# Altium schematic sheet usb_uart.SchDoc: Edison Breakout
size Letter; Author: Ye-Sheng Kuo; Revision: 1; SheetTotal: 9
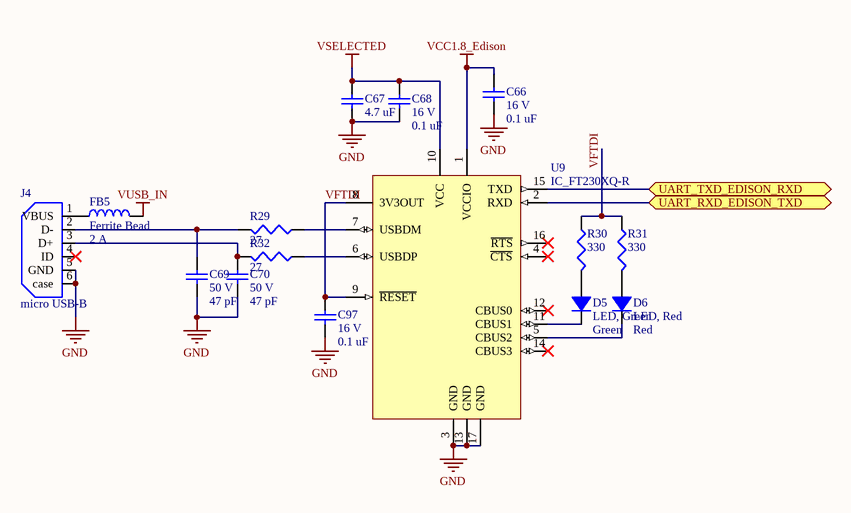
[diagram p0: usb_uart.SchDoc]

## Parts
C66  value 0.1 uF  voltage rated: 16 V  [0402]  (hidden comment: Ceramic capacitor)
C67  value 4.7 uF  [0603]  (hidden comment: Ceramic capacitor)
C68  value 0.1 uF  voltage rated: 16 V  [0402]  (hidden comment: Ceramic capacitor)
C69  value 47 pF  voltage rated: 50 V  [0402]  (hidden comment: Ceramic capacitor)
C70  value 47 pF  voltage rated: 50 V  [0402]  (hidden comment: Ceramic capacitor)
C97  value 0.1 uF  voltage rated: 16 V  [0402]  (hidden comment: Ceramic capacitor)
D5  LED, Green  Color: Green  [0402 - DIODE]
D6  LED, Red  Color: Red  [0402 - DIODE]
FB5  Ferrite Bead  current rating: 2 A  [0603]
J4  micro USB-B  [Micro USB-B]
R29  value 27  [0402]  (hidden comment: Chip resistor)
R30  value 330  [0402]  (hidden comment: Chip resistor)
R31  value 330  [0402]  (hidden comment: Chip resistor)
R32  value 27  [0402]  (hidden comment: Chip resistor)
U9  IC_FT230XQ-R  [QFN-16]

## Ports
UART_RXD_EDISON_TXD, UART_TXD_EDISON_RXD

## Nets
GND: C66.2 C67.2 C68.2 C69.2 C70.2 C97.2 J4.5(GND) J4.6(case) U9.3(GND) U9.13(GND) U9.17(GND)
VCC1.8_Edison: C66.1 U9.1(VCCIO)
VSELECTED: C67.1 C68.1 U9.10(VCC)
VUSB_IN: FB5.1
UART_RXD_EDISON_TXD: U9.2(RXD) ; port UART_RXD_EDISON_TXD
UART_TXD_EDISON_RXD: U9.15(TXD) ; port UART_TXD_EDISON_RXD
VFTDI: C97.1 R30.2 R31.2 U9.8(3V3OUT) U9.9(~{RESET})
NetC69_1: C69.1 J4.2(D-) R29.1
NetC70_1: C70.1 J4.3(D+) R32.1
NetD5_1: D5.1 R30.1
NetD5_2: D5.2 U9.11(CBUS1)
NetD6_1: D6.1 R31.1
NetD6_2: D6.2 U9.5(CBUS2)
NetFB5_2: FB5.2 J4.1(VBUS)
NetR29_2: R29.2 U9.7(USBDM)
NetR32_2: R32.2 U9.6(USBDP)

Not connected (* = marked no-connect by the designer): J4 4(ID)*; U9 4(~{CTS})* 12(CBUS0)* 14(CBUS3)* 16(~{RTS})*

## Notes on the sheet
- Title
- Date:
- Author:
- Revision:
- Sheet
- of
- University of Michigan
- File:

## Library data of the parts
C66 C68 C97 = C_0.1u_16V_0402_ceramic: Ceramic capacitor, 0.1u, 16 V, 0402 package; Manufacture: Murata; tolerance: 10%; Temperature Coef: X7R; package: 0402; Supplier 1: Digi-Key; Supplier Part Number 1: 490-3261-1-ND
C67 = C_4.7u_10V_0603_ceramic: Ceramic capacitor, 4.7u, 10V, 0603 package; Manufacture: TDK; tolerance: 20%; Temp rating: X5R; package: 0603; voltage rated: 10 V; Supplier 1: Digi-Key; Supplier Part Number 1: 445-7482-1-ND
C69 C70 = C_47p_50V_0402_ceramic: Ceramic capacitor, 47 pF, 0402 package; Manufacture: AVX; tolerance: 5%; package: 0402; Supplier 1: Digi-Key; Supplier Part Number 1: 478-1078-1-ND
D5 = D_LED_GREEN_0402: LED, Green,  0402; package: 0402; Supplier 1: Digi-Key; Supplier Part Number 1: 511-1592-1-ND
D6 = D_LED_RED_0402: LED, Red, 0402; package: 0402; Supplier 1: Digi-Key; Supplier Part Number 1: 511-1593-1-ND
FB5 = FB_2A_0603: Ferrite Bead, 2 A, 0603 package; DC resistance: 50 m; package: 0603; Supplier 1: Digi-Key; Supplier Part Number 1: 553-2387-1-ND
J4 = Micro USB: CONN USB MICRO B RECPT SMT R/A; Supplier 1: Digi-Key; Supplier Part Number 1: 609-4616-1-ND
R29 R32 = R_27_0402: Chip resistor, 27, 0402 package; tolerance: 1%; power: 1/16 W; package: 0402; Supplier 1: Digi-Key; Supplier Part Number 1: 541-27.0LCT-ND
R30 R31 = R_330_0402: Chip resistor, 330, 0402 package; tolerance: 1%; power: 1/16 W; package: 0402; Supplier 1: Digi-Key; Supplier Part Number 1: 541-330LCT-ND
U9 = IC_FT230XQ-R: FT230X USB UART; Manufacturer: *; Note: *; ManufacturerPartNo: *; Supplier 1: Digi-Key; Supplier Part Number 1: 768-1130-1-ND